# EAGLE design rapidshark-lipo-sensor-mk-2.2 (EAGLE 6.5.0)
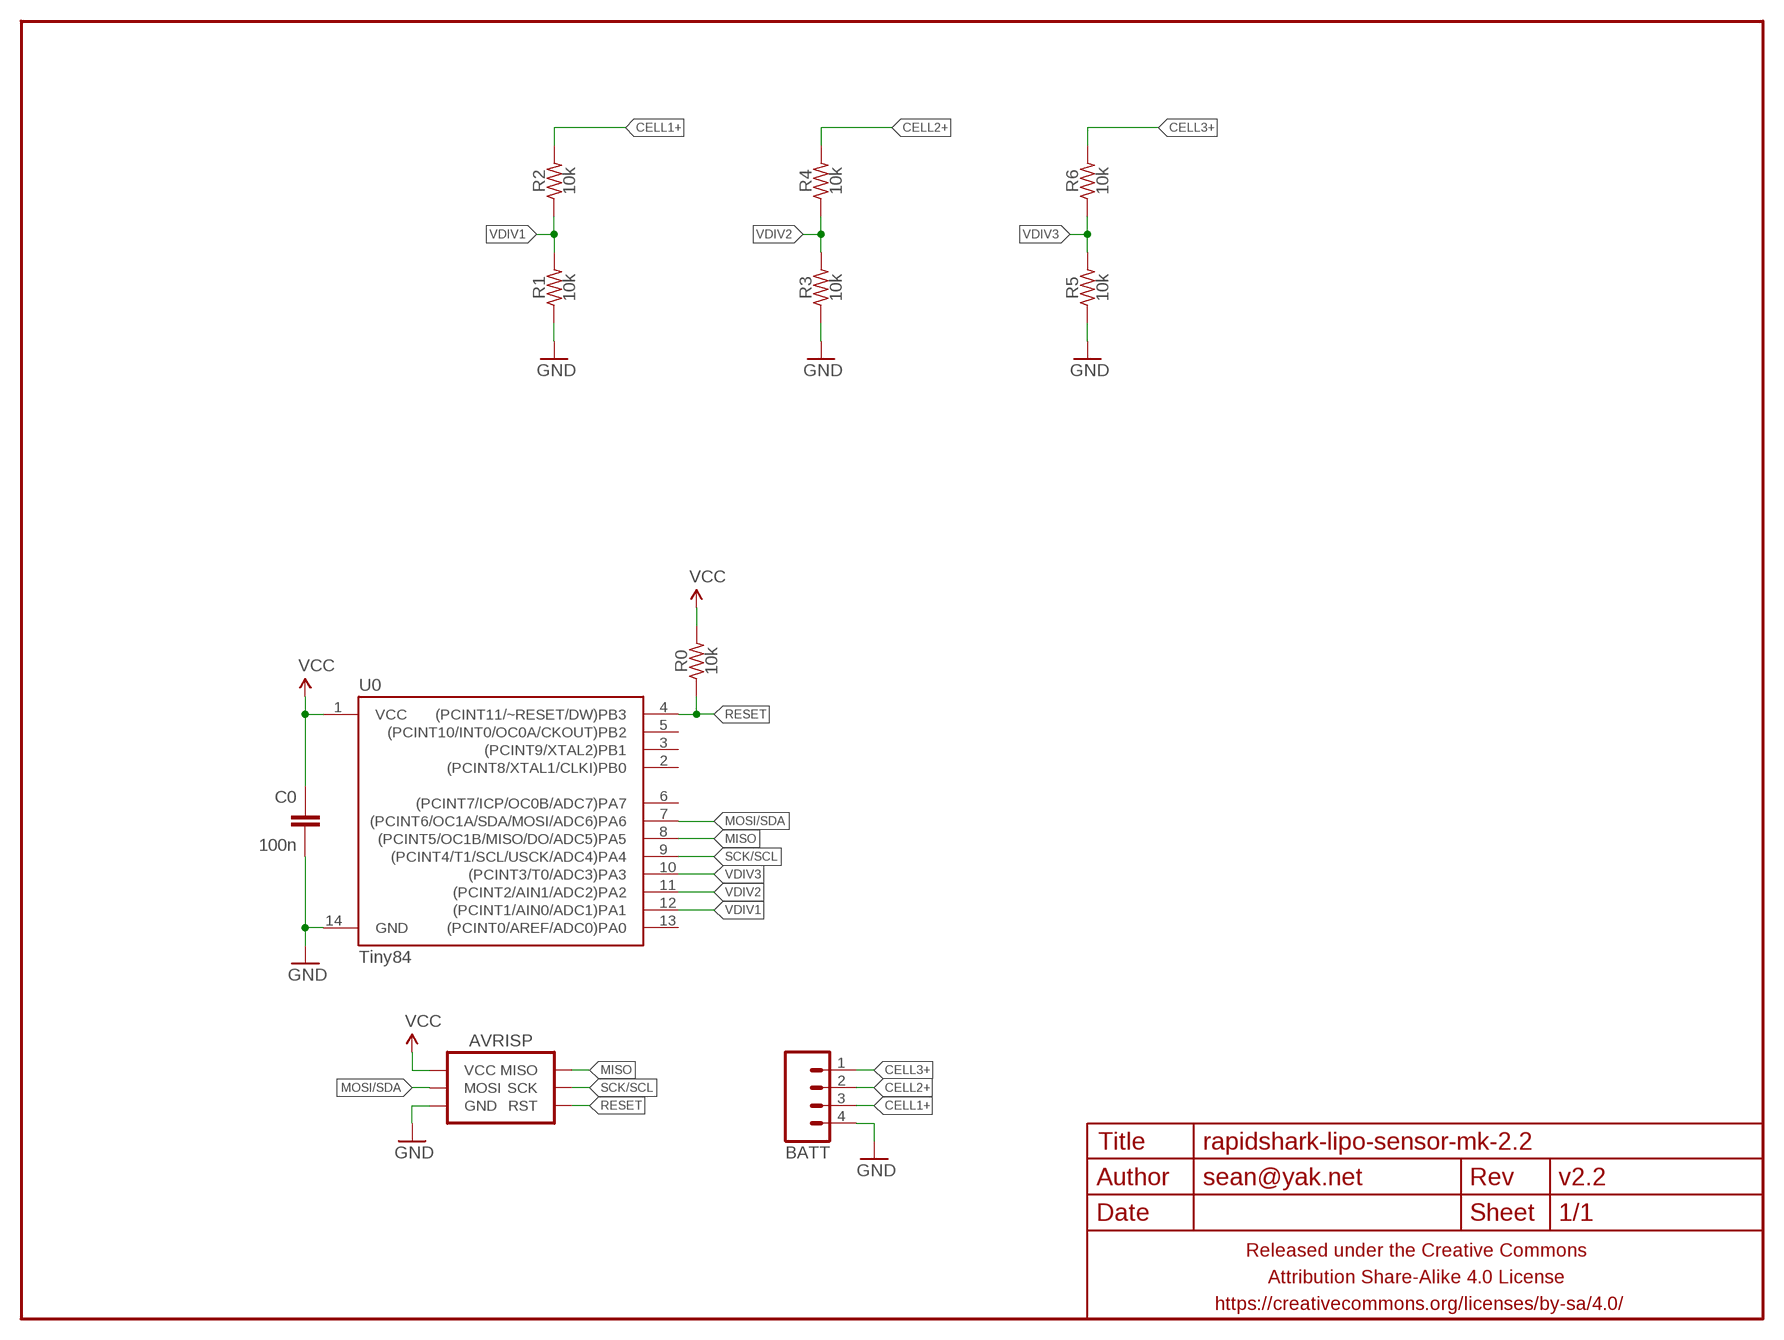
[diagram p0: schematic, sheet 1]

## Parts
AVRISP  AVR_SPI_PRG_6PTH_INLINE_I2C  [AVR_ISP_INLINE_PTH_I2C]
BATT  M04JST_XH_VERT  [JST-4-XH-VERT-TH]
C0  100n  CAPACITOR-CERAMIC025-024X044  [C025-024X044]
FRAME1  FRAME-LETTERNO_PACKAGE  [DUMMY]
R0  10k  RESISTORPTH-AXIAL-5.08MM  [RESISTOR-AXIAL-PTH-5.08MM]
R1  10k  RESISTORPTH-AXIAL-5.08MM  [RESISTOR-AXIAL-PTH-5.08MM]
R2  10k  RESISTORPTH-AXIAL-5.08MM  [RESISTOR-AXIAL-PTH-5.08MM]
R3  10k  RESISTORPTH-AXIAL-5.08MM  [RESISTOR-AXIAL-PTH-5.08MM]
R4  10k  RESISTORPTH-AXIAL-5.08MM  [RESISTOR-AXIAL-PTH-5.08MM]
R5  10k  RESISTORPTH-AXIAL-5.08MM  [RESISTOR-AXIAL-PTH-5.08MM]
R6  10k  RESISTORPTH-AXIAL-5.08MM  [RESISTOR-AXIAL-PTH-5.08MM]
U0  Tiny84  ATTINY84ATTINY84-20PU  [DIL14]

## Nets
CELL1+: BATT.3 R2.P$2
CELL2+: BATT.2 R4.P$2
CELL3+: BATT.1 R6.P$2
GND: AVRISP.GND BATT.4 C0.2 R1.P$1 R3.P$1 R5.P$1 U0.14(GND)
MISO: AVRISP.MISO U0.8((PCINT5/OC1B/MISO/DO/ADC5)PA5)
MOSI/SDA: AVRISP.MOSI U0.7((PCINT6/OC1A/SDA/MOSI/ADC6)PA6)
RESET: AVRISP.RESET(RST) R0.P$1 U0.4((PCINT11/~RESET/DW)PB3)
SCK/SCL: AVRISP.SCK U0.9((PCINT4/T1/SCL/USCK/ADC4)PA4)
VCC: AVRISP.VCC C0.1 R0.P$2 U0.1(VCC)
VDIV1: R1.P$2 R2.P$1 U0.12((PCINT1/AIN0/ADC1)PA1)
VDIV2: R3.P$2 R4.P$1 U0.11((PCINT2/AIN1/ADC2)PA2)
VDIV3: R5.P$2 R6.P$1 U0.10((PCINT3/T0/ADC3)PA3)
Unconnected: U0.2((PCINT8/XTAL1/CLKI)PB0) U0.3((PCINT9/XTAL2)PB1) U0.5((PCINT10/INT0/OC0A/CKOUT)PB2) U0.6((PCINT7/ICP/OC0B/ADC7)PA7) U0.13((PCINT0/AREF/ADC0)PA0)

## Library data of the parts
AVRISP = A_butts:AVR_SPI_PRG_6: AVR ISP 6 Pin This is the reduced ISP connector for AVR programming. Common on Arduino. This footprint will take up less PCB space and can be used with a 10-pin to 6-pin adapter such as SKU: BOB-08508 **Special note about "TEST_POINT" package. The stop mask is on the top side, so if you want your programming test points to be on the bottom of your board, make sure to place this package on the bottom side of the board. This also ensure that the orientation to program from the bottom side will be correct.
BATT = a_parts:M04: Header 4 Standard 4-pin 0.1" header. Use with straight break away headers (SKU : PRT-00116), right angle break away headers (PRT-00553), swiss pins (PRT-00743), machine pins (PRT-00117), and female headers (PRT-00115). Molex polarized connector foot print use with SKU : PRT-08231 with associated crimp pins and housings. 1MM SMD Version SKU: PRT-10208
C0 = A_butts:CAPACITOR-CERAMIC: CAPACITOR, European symbol
FRAME1 = A_butts:FRAME-LETTER: Schematic Frame Standard 8.5x11 US Letter frame; DESIGNER: sean@yak.net; VERSION: v2.2
R0 R1-R6 = A_butts:RESISTOR: RESISTOR, American symbol
U0 = A_butts:ATTINY84: Atmel 14-pin 2/4/8kB flash uC

## Board
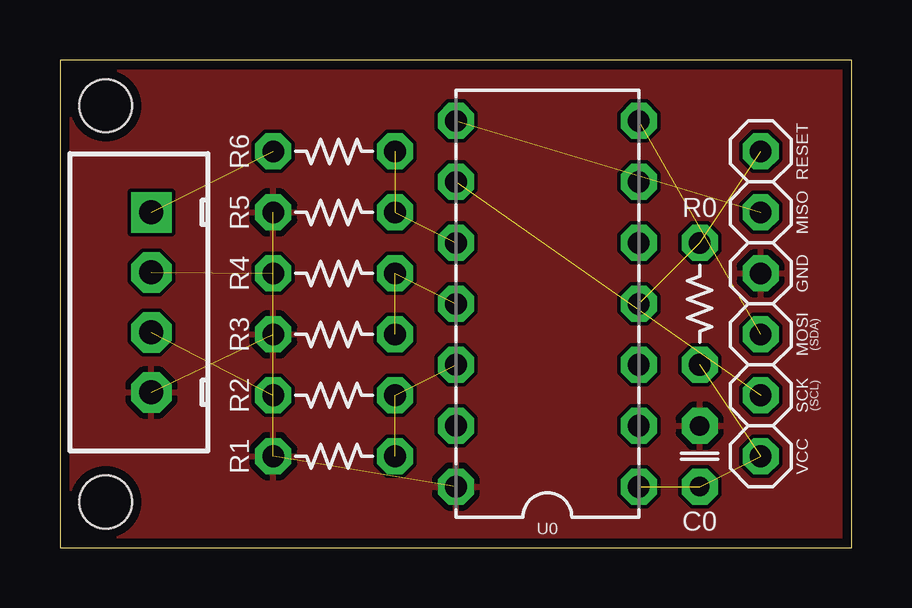
[diagram p1: board, top side]
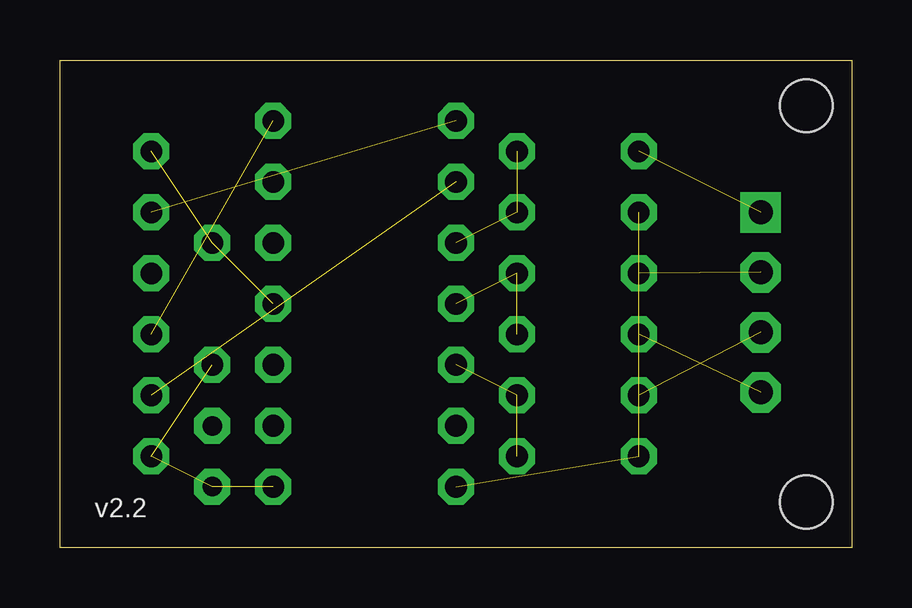
[diagram p2: board, bottom side, seen from below]

Size 33.02 x 20.32 mm. Coordinates in mm from the lower left corner, seen from the top.
Outline: 0,20.32 0,0 33.02,0 33.02,20.32 0,20.32
Copper layers (1*16): Top 0.0356mm / dielectric 1.5011mm / Bottom 0.0356mm
Design rules "LaenPCBOrder_2": minimum track width 6mil, minimum drill 13mil, track to track 6mil, track to pad 6mil, pad to pad 6mil, via to via 6mil, smd to smd 6mil, copper to edge 15mil, drill to drill 6mil, minimum pad ring 7mil, minimum via ring 7mil, stop-mask expansion 3mil, vias tented up to drill 20mil, thermal gap 10mil
Holes 2.2 mm at 1.91,18.41 1.91,1.91

### Footprints (pad centres in the part's own frame; a part is rotated, then mirrored left to right if it is on the bottom)
AVR_ISP_INLINE_PTH_I2C = drill 0.9 pad 1.5 octagon: GND 1.27,0; MISO 3.81,0; MOSI -1.27,0; RESET 6.35,0; SCK -3.81,0; VCC -6.35,0
JST-4-XH-VERT-TH = drill 1 pad 1.676 square: 1 0,0 | drill 1 pad 1.676 octagon: 2 2.5,0; 3 5,0; 4 7.5,0
C025-024X044 = drill 0.813 pad 1.5 octagon: 1 -1.27,0; 2 1.27,0
RESISTOR-AXIAL-PTH-5.08MM = drill 0.9 pad 1.5 octagon: P$1 -2.54,0; P$2 2.54,0
DIL14 = drill 0.9 pad 1.5 octagon: 1 -7.62,-3.81; 2 -5.08,-3.81; 3 -2.54,-3.81; 4 0,-3.81; 5 2.54,-3.81; 6 5.08,-3.81; 7 7.62,-3.81; 8 7.62,3.81; 9 5.08,3.81; 10 2.54,3.81; 11 0,3.81; 12 -2.54,3.81; 13 -5.08,3.81; 14 -7.62,3.81

### Placement (x,y rotation side)
AVRISP  29.21,10.16 90 top
BATT  3.81,13.97 270 top
C0  26.67,3.81 90 top
FRAME1  0,0 0 top
R0  26.67,10.16 270 top
R1  11.43,3.81 0 top
R2  11.43,6.35 180 top
R3  11.43,8.89 0 top
R4  11.43,11.43 180 top
R5  11.43,13.97 0 top
R6  11.43,16.51 180 top
U0  20.32,10.16 90 top

### Tracks (layer width: path | path; a pad name or v marks a point on that pad's centre or on a via)
CELL1+  (1 unrouted)
CELL2+  (1 unrouted)
CELL3+  (1 unrouted)
GND  (4 unrouted)
  pour Top: 0,20.32 33.02,20.32 33.02,0 0,0
MISO  (1 unrouted)
MOSI/SDA  (1 unrouted)
RESET  (2 unrouted)
SCK/SCL  (1 unrouted)
VCC  (3 unrouted)
VDIV1  (2 unrouted)
VDIV2  (2 unrouted)
VDIV3  (2 unrouted)